# EasyEDA schematic dc_adj_2021-05-20.json
TITLE: DC_adj; REV: 1.0; Date: 2021-04-24; Sheet: 1/1; Drawn By: YHF_1404; Company: Your Company
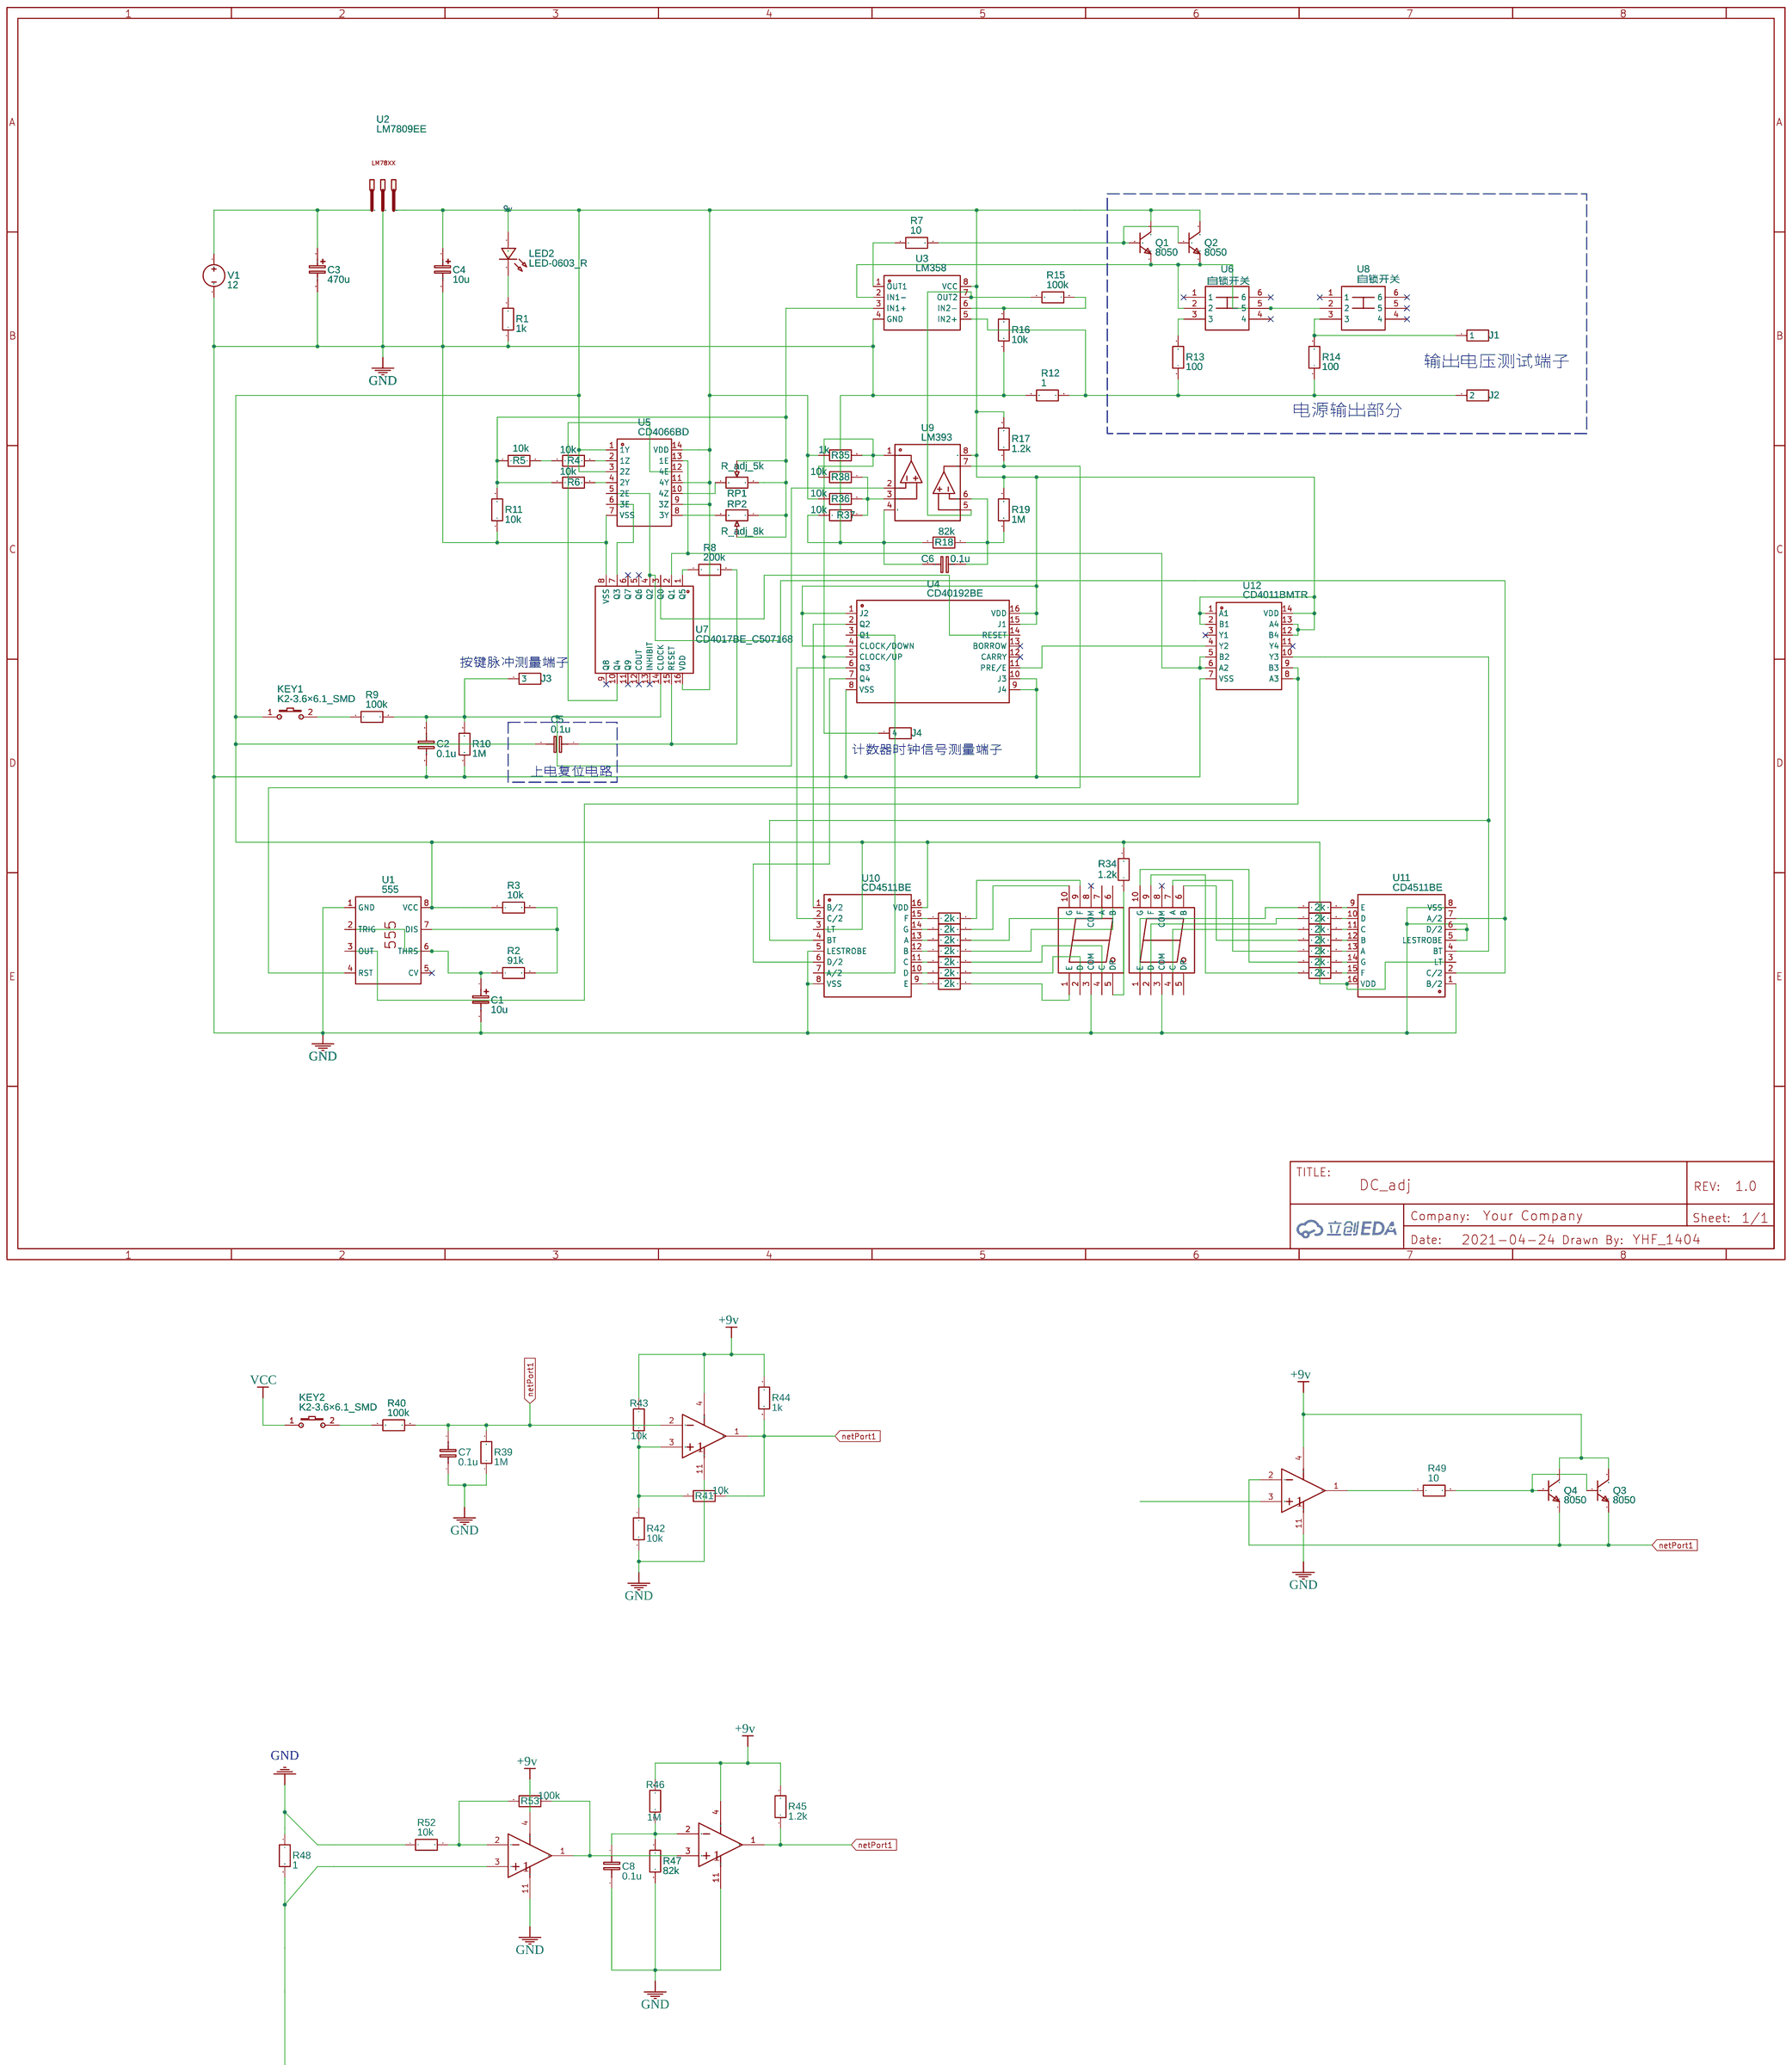
[diagram p0: schematic sheet]

## Parts
C1  10u  [CASE-A_3216]
C2  0.1u  [C0603]
C3  470u  [CASE-A_3216]
C4  10u  [CASE-A_3216]
C5  0.1u  [C0603]
C6  0.1u  [C0603]
C7  0.1u  [C0603]
C8  0.1u  [C0603]
J1  HDR-M-2.54_1x1  [HDR-M-2.54_1X1]
J2  HDR-M-2.54_1x1  [HDR-M-2.54_1X1]
J3  HDR-M-2.54_1x1  [HDR-M-2.54_1X1]
J4  HDR-M-2.54_1x1  [HDR-M-2.54_1X1]
KEY1  K2-3.6×6.1_SMD  [KEY-SMD_2P-L6.2-W3.6-LS8.0]
KEY2  K2-3.6×6.1_SMD  [KEY-SMD_2P-L6.2-W3.6-LS8.0]
LED1  SLS0391FB4A1GD  [LED-SEG-SMD_SLS0391FB4A1GD]
LED2  LED-0603_R  [LED0603_RED]
LED3  SLS0391FB4A1GD  [LED-SEG-SMD_SLS0391FB4A1GD]
Q1  8050  [SOT-23-3_L2.9-W1.3-P1.90-LS2.4-TR]
Q2  8050  [SOT-23-3_L2.9-W1.3-P1.90-LS2.4-TR]
Q3  8050  [SOT-23-3_L2.9-W1.3-P1.90-LS2.4-TR]
Q4  8050  [SOT-23-3_L2.9-W1.3-P1.90-LS2.4-TR]
R1  1k  [R0603]
R2  91k  [R0603]
R3  10k  [R0603]
R4  10k  [R0603]
R5  10k  [R0603]
R6  10k  [R0603]
R7  10  [R0603]
R8  200k  [R0603]
R9  100k  [R0603]
R10  1M  [R0603]
R11  10k  [R0603]
R12  1  [R0603]
R13  100  [R0603]
R14  100  [R0603]
R15  100k  [R0603]
R16  10k  [R0603]
R17  1.2k  [R0603]
R18  82k  [R0603]
R19  1M  [R0603]
R20  2k  [R0603]
R21  2k  [R0603]
R22  2k  [R0603]
R23  2k  [R0603]
R24  2k  [R0603]
R25  2k  [R0603]
R26  2k  [R0603]
R27  2k  [R0603]
R28  2k  [R0603]
R29  2k  [R0603]
R30  2k  [R0603]
R31  2k  [R0603]
R32  2k  [R0603]
R33  2k  [R0603]
R34  1.2k  [R0603]
R35  1k  [R0603]
R36  10k  [R0603]
R37  10k  [R0603]
R38  10k  [R0603]
R39  1M  [R0603]
R40  100k  [R0603]
R41  10k  [R0603]
R42  10k  [R0603]
R43  10k  [R0603]
R44  1k  [R0603]
R45  1.2k  [R0603]
R46  1M  [R0603]
R47  82k  [R0603]
R48  1  [R0603]
R49  10  [R0603]
R52  10k  [R0603]
R53  100k  [R0603]
RP1  R_adj_5k  [RES-ADJ-TH_3386P]
RP2  R_adj_8k  [RES-ADJ-TH_3386P]
U1  555  [DIP08]
U2  LM7809EE
U3  LM358
U4  CD40192BE  [DIP-16_L19.2-W6.6-P2.54-LS7.6-BL]
U5  CD4066BD  [SOP-14_L8.6-W3.9-P1.27-LS6.0-BL]
U6  自锁开关  [自锁开关]
U7  CD4017BE_C507168  [DIP-16_L19.2-W6.6-P2.54-LS7.6-BL]
U8  自锁开关  [自锁开关]
U9  LM393  [SOP-8_L4.9-W3.9-P1.27-LS6.0-BL]
U10  CD4511BE  [DIP-16_L19.8-W6.5-P2.54-LS7.6-BL]
U11  CD4511BE  [DIP-16_L19.8-W6.5-P2.54-LS7.6-BL]
U12  CD4011BMTR  [SOIC-14_L8.7-W3.9-P1.27-LS6.0-BL]
U13  LM324NG  [PDIP-14_L19.7-W6.6-P2.54-LS8.3-BL]  (section 1)
U14  LM324NG  [PDIP-14_L19.7-W6.6-P2.54-LS8.3-BL]  (section 1)
U15  LM324NG  [PDIP-14_L19.7-W6.6-P2.54-LS8.3-BL]  (section 1)
U16  LM324NG  [PDIP-14_L19.7-W6.6-P2.54-LS8.3-BL]  (section 1)
V1  12  [HDR1X2]

## Library data of the parts
C1 C3 C4 = C_Tan_SMD_A_EU: Contributor: LCEDA_Lib
C2 C5-C8 = C_0603_EU: Contributor: LCEDA_Lib
J1-J4 = HDR-M-2.54_1x1: Supplier Part: C81276; Supplier: LCSC; Contributor: LCEDA_Lib
KEY1 KEY2 = K2-3.6×6.1_SMD: Supplier Part: C118141; Supplier: LCSC; Manufacturer Part: K2-1107ST-A4SW-06; Contributor: LCEDA_Lib; 制造商: 韩国韩荣
LED1 LED3 = SLS0391FB4A1GD: Supplier: LCSC; Supplier Part: C225997; Manufacturer: SUNLIGHT; Contributor: LCSC; Paste Type: expand
LED2 = LED-0603_R: Manufacturer: EVERLIGHT(台湾亿光); Manufacturer Part: 19-217/R6C-AL1M2VY/3T; Supplier Part: C72044; Supplier: LCSC; Contributor: LCEDA_01
Q1-Q4 = 2N3904(SOT-23): Supplier: LCSC; Manufacturer: KEC; Manufacturer Part: 2n3904S-RTK/PS; Supplier Part: C18536; Paste Type: SOT-23; Contributor: LCEDA_Lib
R1-R49 R52 R53 = R_0603_EU: Contributor: LCEDA_Lib
RP1 RP2 = R_3386P_EU: Supplier: LCSC; Contributor: LCEDA_Lib; Value(Ω): 10K
U1 = 555: Contributor: Dillon
U2 = 78XX: catid: 20; Contributor: EasyEDA; sim: true
U3 = LM358: catid: 20; Contributor: CCH...2; sim: true
U4 = CD40192BE: Supplier: LCSC; Manufacturer: TI; image: //image.lceda.cn/szlcsc/C28216.jpg; Supplier Part: C28216
U5 = CD4066BD: Supplier: LCSC; Supplier Part: C558790; Manufacturer: HTC Korea TAEJIN Tech; Contributor: LCSC
U6 U8 = 自锁开关: Manufacturer Part: New SchematicLib; Contributor: norman_su
U7 = CD4017BE_C507168: Supplier: LCSC; Supplier Part: C507168; Manufacturer: HGSEMI; Manufacturer Part: CD4017BE; Contributor: LCSC
U9 = LM393: Supplier: LCSC; Supplier Part: C351428; Manufacturer: PUOLOP; Contributor: LCSC; Paste Type: expand
U10 U11 = CD4511BE: Supplier: LCSC; Manufacturer: TI; image: //image.lceda.cn/szlcsc/C5327.jpg; Supplier Part: C5327
U12 = CD4011BMTR: Supplier: LCSC; Supplier Part: C194334; Manufacturer: HGSEMI; Contributor: LCSC; Paste Type: expand
U13-U16 = LM324NG: Supplier Part: C99121; Supplier: LCSC; Manufacturer Part: ON; subpart_no: 1
V1 = VDC: Contributor: EasyEDA; sim: true

## Nets
9v: C4.1 C5.2 KEY1.1 LED2.1 Q1.3(C) Q2.3(C) R3.1 R17.2 R19.2 R34.2 R35.2 R36.2 U1.8(VCC) U2.3(OUT) U3.8(VCC) U4.1(J2) U4.4(CLOCK/DOWN) U4.15(J1) U4.16(VDD) U5.1(1Y) U5.3(2Z) U5.9(3Z) U5.11(4Y) U5.14(VDD) U7.16(VDD) U9.8(VDD) U10.3(LT) U10.16(VDD) U11.3(LT) U11.16(VDD) U12.1(A1) U12.2(B1) U12.12(B4) U12.13(A4) U12.14(VDD)
+9v: Q3.3(C) Q4.3(C) R43.1 R44.1 R45.1 R46.1 U13.4(VCC) U14.4(VCC) U15.4(VCC) U16.4(VCC)
GND: C1.2 C2.1 C3.2 C4.2 C6.2 C7.1 C8.2 LED1.3(COM) LED3.3(COM) R1.1 R10.1 R11.1 R12.1 R16.1 R18.1 R37.2 R39.1 R42.2 R47.2 R48.1 R52.1 U1.1(GND) U2.2(GND) U3.4(GND) U4.8(VSS) U4.9(J4) U4.10(J3) U5.7(VSS) U7.8(VSS) U9.4(GND) U10.5(LESTROBE) U10.8(VSS) U11.1(B/2) U11.5(LESTROBE) U11.6(D/2) U11.8(VSS) U12.7(VSS) U13.11(GND) U14.11(GND) U15.11(GND) U16.11(GND) V1.2
VCC: KEY2.1
netPort1: C7.2 Q3.1(E) Q4.1(E) R39.2 R40.2 R41.2 R44.2 R45.2 U13.1(OUT1) U13.2(IN1-) U14.2(IN1-) U15.1(OUT1)
Net-(C1-1): C1.1 R2.1 U1.2(TRIG) U1.6(THRS)
Net-(C2-2): C2.2 J3.1(3) R9.2 R10.2 U7.14(CLOCK) U9.2
Net-(C3-1): C3.1 U2.1(IN) V1.1
Net-(C5-1): C5.1 R8.2 U7.15(RESET)
Net-(C6-1): C6.1 R18.2 R19.1 U9.6
Net-(C8-1): C8.1 R46.2 R47.1 U15.2(IN1-)
Net-(J1-1): J1.1 R14.2 U8.3
Net-(J2-1): J2.1(2) R12.2 R13.1 R14.1 U3.5(IN2+)
Net-(J4-1): J4.1(4) R35.1 R38.2 U4.5(CLOCK/UP) U9.1
Net-(KEY1-2): KEY1.2 R9.1
Net-(KEY2-2): KEY2.2 R40.1
Net-(LED1-1): LED1.1(E) R33.1
Net-(LED1-2): LED1.2(D) R32.1
Net-(LED1-4): LED1.4(C) R31.1
Net-(LED1-6): LED1.6(B) R30.1
Net-(LED1-7): LED1.7(A) R29.1
Net-(LED1-9): LED1.9(F) R27.1
Net-(LED1-10): LED1.10(G) R28.1
Net-(LED2-2): LED2.2 R1.2
Net-(LED3-1): LED3.1(E) R26.2
Net-(LED3-2): LED3.2(D) R25.2
Net-(LED3-4): LED3.4(C) R24.2
Net-(LED3-5): LED3.5(DP) R34.1
Net-(LED3-6): LED3.6(B) R23.2
Net-(LED3-7): LED3.7(A) R22.2
Net-(LED3-9): LED3.9(F) R20.2
Net-(LED3-10): LED3.10(G) R21.2
Net-(Q1-1): Q1.1(E) Q2.1(E) U3.2(IN1-) U6.2 U6.5 U8.2
Net-(Q1-2): Q1.2(B) Q2.2(B) R7.2
Net-(Q3-2): Q3.2(B) Q4.2(B) R49.2
Net-(R2-2): R2.2 R3.2 U1.7(DIS)
Net-(R4-1): R4.1 R5.2
Net-(R4-2): R4.2 U5.2(1Z)
Net-(R5-1): R5.1 R6.1 R11.2 RP1.2 RP1.3 RP2.1 RP2.2 U3.3(IN1+)
Net-(R6-2): R6.2 U5.4(2Y)
Net-(R7-1): R7.1 U3.1(OUT1)
Net-(R8-1): R8.1 U7.1(Q5)
Net-(R13-2): R13.2 U6.3
Net-(R15-1): R15.1 U3.7(OUT2) U9.5
Net-(R15-2): R15.2 R16.2 U3.6(IN2-)
Net-(R17-1): R17.1 U1.4(RST) U9.7
Net-(R20-1): R20.1 U10.15(F)
Net-(R21-1): R21.1 U10.14(G)
Net-(R22-1): R22.1 U10.13(A)
Net-(R23-1): R23.1 U10.12(B)
Net-(R24-1): R24.1 U10.11(C)
Net-(R25-1): R25.1 U10.10(D)
Net-(R26-1): R26.1 U10.9(E)
Net-(R27-2): R27.2 U11.15(F)
Net-(R28-2): R28.2 U11.14(G)
Net-(R29-2): R29.2 U11.13(A)
Net-(R30-2): R30.2 U11.12(B)
Net-(R31-2): R31.2 U11.11(C)
Net-(R32-2): R32.2 U11.10(D)
Net-(R33-2): R33.2 U11.9(E)
Net-(R36-1): R36.1 R37.1 R38.1 U9.3
Net-(R41-1): R41.1 R42.1 R43.2 U13.3(IN1+)
Net-(R48-2): R48.2 U16.3(IN1+)
Net-(R49-1): R49.1 U14.1(OUT1)
Net-(R52-2): R52.2 R53.1 U16.2(IN1-)
Net-(R53-2): R53.2 U15.3(IN1+) U16.1(OUT1)
Net-(RP1-1): RP1.1 U5.10(4Z)
Net-(RP2-3): RP2.3 U5.8(3Y)
Net-(U4-2): U4.2(Q2) U10.1(B/2)
Net-(U4-3): U4.3(Q1) U10.7(A/2)
Net-(U4-6): U4.6(Q3) U10.2(C/2)
Net-(U4-7): U4.7(Q4) U10.6(D/2)
Net-(U4-11): U4.11(PRE/E) U12.4(Y2)
Net-(U4-14): U4.14(RESET) U7.3(Q0)
Net-(U5-5): U5.5(2E) U7.4(Q2) U11.2(C/2) U11.7(A/2)
Net-(U5-6): U5.6(3E) U7.7(Q3)
Net-(U5-12): U5.12(4E) U7.10(Q4)
Net-(U5-13): U5.13(1E) U7.2(Q1) U12.5(B2) U12.6(A2)
Net-(U10-4): U10.4(BT) U11.4(BT) U12.10(Y3)
Net-(U12-8): U12.8(A3) U12.9(B3)

Not connected (* = marked no-connect by the designer): LED1 5(DP) 8(COM)*; LED3 8(COM)*; U1 3(OUT) 5(CV)*; U4 12(CARRY)* 13(BORROW)*; U6 1* 4* 6*; U7 5(Q6)* 6(Q7)* 9(Q8)* 11(Q9)* 12(COUT)* 13(INHIBIT)*; U8 1* 4* 5* 6*; U12 3(Y1)* 11(Y4)*; U14 3(IN1+)

## Notes on the sheet
- 输出电压测试端子
- 电源输出部分
- 按键脉冲测量端子
- 计数器时钟信号测量端子
- 上电复位电路
